# Altium schematic sheet resolver_ad2s1210.SchDoc
size B; SheetNumber: 13
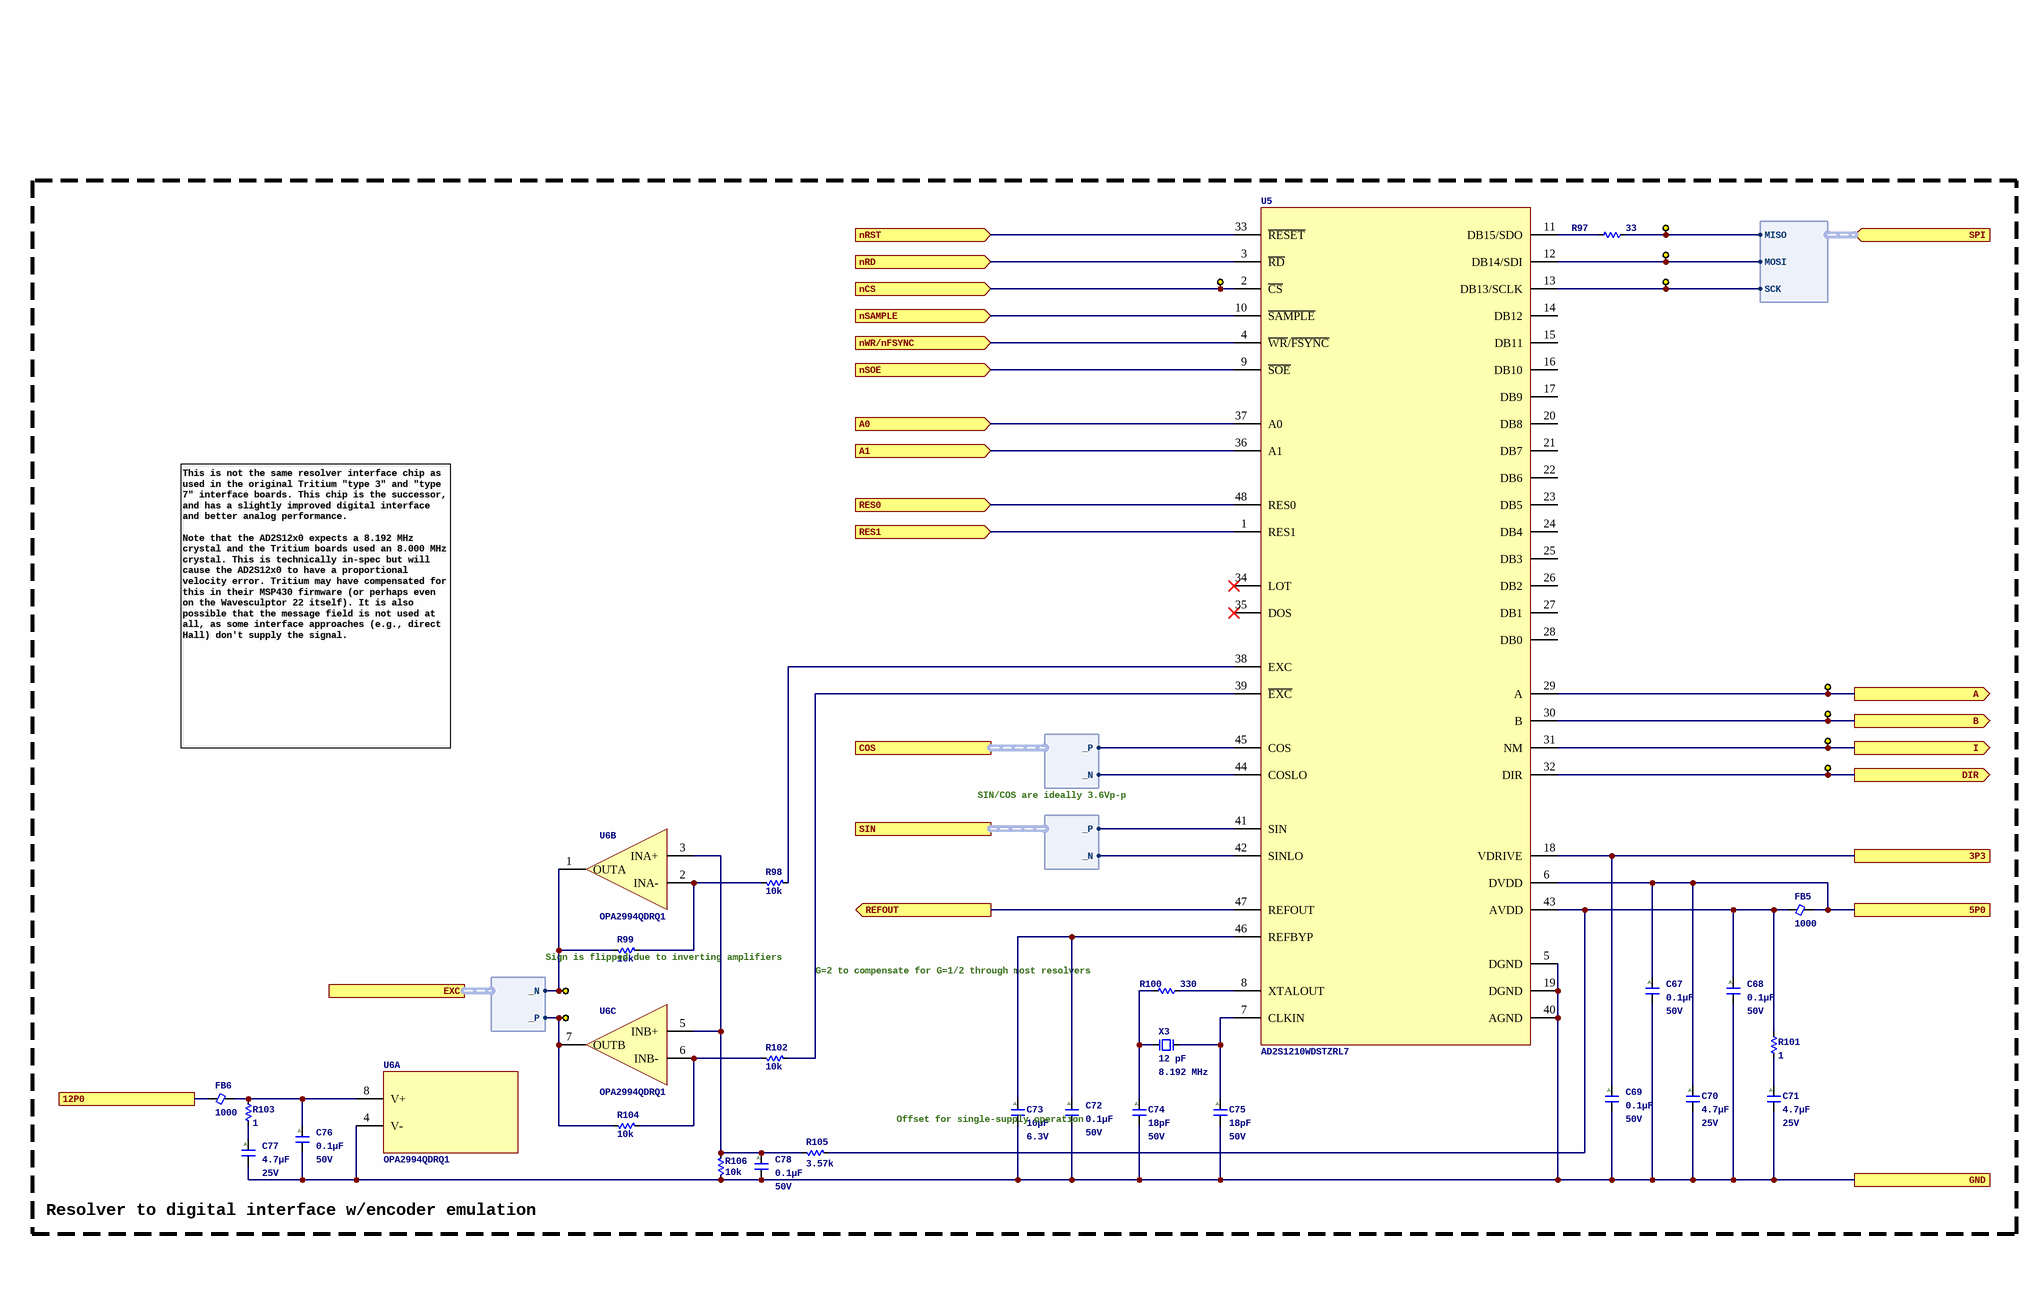
[diagram p0: resolver_ad2s1210.SchDoc]

## Parts
C67  Capacitance: 0.1µF  Voltage - Rated: 50V  [C0402_0.55MM]  (hidden comment: CGA2B3X7R1H104M050BB)
C68  Capacitance: 0.1µF  Voltage - Rated: 50V  [C0402_0.55MM]  (hidden comment: CGA2B3X7R1H104M050BB)
C69  Capacitance: 0.1µF  Voltage - Rated: 50V  [C0402_0.55MM]  (hidden comment: CGA2B3X7R1H104M050BB)
C70  Capacitance: 4.7µF  Voltage - Rated: 25V  [C0805_1.45MM]  (hidden comment: CGA4J1X7R1E475K125AC)
C71  Capacitance: 4.7µF  Voltage - Rated: 25V  [C0805_1.45MM]  (hidden comment: CGA4J1X7R1E475K125AC)
C72  Capacitance: 0.1µF  Voltage - Rated: 50V  [C0402_0.55MM]  (hidden comment: CGA2B3X7R1H104M050BB)
C73  Capacitance: 10µF  Voltage - Rated: 6.3V  [C0805_1.45MM]  (hidden comment: CGA4J1X7R0J106M125AC)
C74  Capacitance: 18pF  Voltage - Rated: 50V  [C0402_0.55MM]  (hidden comment: CGA2B2C0G1H180J050BA)
C75  Capacitance: 18pF  Voltage - Rated: 50V  [C0402_0.55MM]  (hidden comment: CGA2B2C0G1H180J050BA)
C76  Capacitance: 0.1µF  Voltage - Rated: 50V  [C0402_0.55MM]  (hidden comment: CGA2B3X7R1H104M050BB)
C77  Capacitance: 4.7µF  Voltage - Rated: 25V  [C0805_1.45MM]  (hidden comment: CGA4J1X7R1E475K125AC)
C78  Capacitance: 0.1µF  Voltage - Rated: 50V  [C0402_0.55MM]  (hidden comment: CGA2B3X7R1H104M050BB)
FB5  Impedance (Ohms @ 100MHz): 1000  [FB0805_1.05MM]  (hidden comment: MPZ2012S102AT000)
FB6  Impedance (Ohms @ 100MHz): 1000  [FB0805_1.05MM]  (hidden comment: MPZ2012S102AT000)
R97  Resistance: 33  [R0402_0.40MM]  (hidden comment: ERJ-2RKF33R0X)
R98  Resistance: 10k  [R0402_0.40MM]  (hidden comment: ERJ-2RKF1002X)
R99  Resistance: 10k  [R0402_0.40MM]  (hidden comment: ERJ-2RKF1002X)
R100  Resistance: 330  [R0402_0.40MM]  (hidden comment: ERJ-PA2F3300X)
R101  Resistance: 1  [R0402_0.40MM]  (hidden comment: ERJ-2BQF1R0X)
R102  Resistance: 10k  [R0402_0.40MM]  (hidden comment: ERJ-2RKF1002X)
R103  Resistance: 1  [R0402_0.40MM]  (hidden comment: ERJ-2BQF1R0X)
R104  Resistance: 10k  [R0402_0.40MM]  (hidden comment: ERJ-2RKF1002X)
R105  Resistance: 3.57k  [R0402_0.40MM]  (hidden comment: ERJ-2RKF3571X)
R106  Resistance: 10k  [R0402_0.40MM]  (hidden comment: ERJ-2RKF1002X)
TP5  (no value)  [TP_GRABBY]  (no BOM)
TP6  (no value)  [TP_GRABBY]  (no BOM)
TP7  (no value)  [TP_GRABBY]  (no BOM)
TP18  (no value)  [TP_GRABBY]  (no BOM)
TP19  (no value)  [TP_GRABBY]  (no BOM)
TP20  (no value)  [TP_GRABBY]  (no BOM)
TP21  (no value)  [TP_GRABBY]  (no BOM)
TP22  (no value)  [TP_GRABBY]  (no BOM)
TP23  RH-5002  [TP_RH-5002]  (value not drawn)
TP24  RH-5002  [TP_RH-5002]  (value not drawn)
U5  AD2S1210WDSTZRL7  [48TQFP7]
U6  OPA2994QDRQ1  [8SOIC150]  (parts A,B,C of 3)
X3  Load Capacitance: 12 pF  Frequency: 8.192 MHz  [XTAL_ECX-53Q]  (hidden comment: ECS-81.92-12-30Q-EN-TR)

## Ports
3P3, 5P0, 12P0, A0 (in), A1 (in), A (out), B (out), COS (harness DIFF), DIR (out), EXC (harness DIFF), GND, I (out), nCS (in), nRD (in), nRST (in), nSAMPLE (in), nSOE (in), nWR/nFSYNC (in), REFOUT (out), RES0 (in), RES1 (in), SIN (harness DIFF), SPI (in, harness SPI)

## Harnesses
DIFF: _P, _N
SPI: MISO, MOSI, SCK

## Nets
3P3: C69.1 U5.18(VDRIVE) ; port 3P3
5P0: C67.1 C70.1 FB5.2 U5.6(DVDD) ; port 5P0
12P0: FB6.1 ; port 12P0
A: TP18.1 U5.29(A) ; port A
A0: U5.37(A0) ; port A0
A1: U5.36(A1) ; port A1
B: TP19.1 U5.30(B) ; port B
DIR: TP21.1 U5.32(DIR) ; port DIR
GND: C67.2 C68.2 C69.2 C70.2 C71.2 C72.2 C73.2 C74.2 C75.2 C76.2 C77.2 C78.2 R106.2 U5.5(DGND) U5.19(DGND) U5.40(AGND) U6.4(V-) ; port GND
I: TP20.1 U5.31(NM) ; port I
nCS: TP22.1 U5.2(~{CS}) ; port nCS
nRD: U5.3(~{RD}) ; port nRD
nRST: U5.33(~{RESET}) ; port nRST
nSAMPLE: U5.10(~{SAMPLE}) ; port nSAMPLE
nSOE: U5.9(~{SOE}) ; port nSOE
nWR/nFSYNC: U5.4(~{WR}/~{FSYNC}) ; port nWR/nFSYNC
REFOUT: U5.47(REFOUT) ; port REFOUT
RES0: U5.48(RES0) ; port RES0
RES1: U5.1(RES1) ; port RES1
NetC68_1: C68.1 FB5.1 R101.2 R105.2 U5.43(AVDD)
NetC71_1: C71.1 R101.1
NetC72_1: C72.1 C73.1 U5.46(REFBYP)
NetC74_1: C74.1 R100.1 X3.1
NetC75_1: C75.1 U5.7(CLKIN) X3.2
NetC76_1: C76.1 FB6.2 R103.2 U6.8(V+)
NetC77_1: C77.1 R103.1
NetC78_1: C78.1 R105.1 R106.1 U6.3(INA+) U6.5(INB+)
NetR97_1: R97.1 TP5.1 ; port SPI.MISO
NetR97_2: R97.2 U5.11(DB15/SDO)
NetR98_1: R98.1 R99.2 U6.2(INA-)
NetR98_2: R98.2 U5.38(EXC)
NetR99_1: R99.1 TP23.1 U6.1(OUTA) ; port EXC._N
NetR100_2: R100.2 U5.8(XTALOUT)
NetR102_1: R102.1 R104.2 U6.6(INB-)
NetR102_2: R102.2 U5.39(~{EXC})
NetR104_1: R104.1 TP24.1 U6.7(OUTB) ; port EXC._P
NetTP6_1: TP6.1 U5.12(DB14/SDI) ; port SPI.MOSI
NetTP7_1: TP7.1 U5.13(DB13/SCLK) ; port SPI.SCK
NetU5_41: U5.41(SIN) ; port SIN._P
NetU5_42: U5.42(SINLO) ; port SIN._N
NetU5_44: U5.44(COSLO) ; port COS._N
NetU5_45: U5.45(COS) ; port COS._P

Not connected (* = marked no-connect by the designer): U5 14(DB12) 15(DB11) 16(DB10) 17(DB9) 20(DB8) 21(DB7) 22(DB6) 23(DB5) 24(DB4) 25(DB3) 26(DB2) 27(DB1) 28(DB0) 34(LOT)* 35(DOS)*

## Notes on the sheet
- This is not the same resolver interface chip as used in the original Tritium "type 3" and "type 7" interface boards. This chip is the successor, and has a slightly improved digital interface and better analog performance.
  Note that the AD2S12x0 expects a 8.192 MHz crystal and the Tritium boards used an 8.000 MHz crystal. This is technically in-spec but will cause the AD2S12x0 to have a proportional velocity error. Tritium may have compensated for this in their MSP430 firmware (or perhaps even on the Wavesculptor 22 itself). It is also possible that the message field is not used at all, as some interface approaches (e.g., direct Hall) don't supply the signal.
- SIN/COS are ideally 3.6Vp-p
- (near TP23) Sign is flipped due to inverting amplifiers
- G=2 to compensate for G=1/2 through most resolvers
- Offset for single-supply operation
- Resolver to digital interface w/encoder emulation
- (in symbol CGA2B2C0G1H180J050BA) A
- (in symbol CGA2B3X7R1H104M050BB) A
- (in symbol CGA4J1X7R0J106M125AC) A
- (in symbol CGA4J1X7R1E475K125AC) A

## Library data of the parts
C67-C69 C72 C76 C78 = CGA2B3X7R1H104M050BB: CAP CER 0.1UF 50V X7R 0402; Manufacturer: TDK Corporation; Unit Price (USD): 0.17; Tolerance: ±20%; ComponentLink1URL: https://product.tdk.com/info/en/catalog/datasheets/mlcc_automotive_general_en.pdf?ref_disty=digikey; ComponentLink1Description: Series Datasheet; Series: CGA; Part Status: Active; Temperature Coefficient: X7R; Operating Temperature: -55°C ~ 125°C; Applications: AEC-Q200; Mounting Type: Surface Mount, MLCC; Package / Case: 0402 (1005 Metric); Size / Dimension: 0.039" L x 0.020" W (1.00mm x 0.50mm); Thickness (Max): 0.022" (0.55mm); Supplier 1: Digikey; Supplier Part Number 1: 445-12271-1-ND; Manufacturer Part Number: CGA2B3X7R1H104M050BB
C70 C71 C77 = CGA4J1X7R1E475K125AC: CAP CER 4.7UF 25V X7R 0805; Manufacturer: TDK Corporation; Unit Price (USD): 0.56; Tolerance: ±10%; ComponentLink1URL: https://product.tdk.com/info/en/catalog/datasheets/mlcc_automotive_general_en.pdf?ref_disty=digikey; ComponentLink1Description: Series Datasheet; Series: CGA; Part Status: Active; Temperature Coefficient: X7R; Operating Temperature: -55°C ~ 125°C; Applications: AEC-Q200; Mounting Type: Surface Mount, MLCC; Package / Case: 0805 (2012 Metric); Size / Dimension: 0.079" L x 0.049" W (2.00mm x 1.25mm); Thickness (Max): 0.057" (1.45mm); Supplier 1: Digikey; Supplier Part Number 1: 445-6967-1-ND; Manufacturer Part Number: CGA4J1X7R1E475K125AC
C73 = CGA4J1X7R0J106M125AC: CAP CER 10UF 6.3V X7R 0805; Manufacturer: TDK Corporation; Unit Price (USD): 0.43; Tolerance: ±20%; ComponentLink1URL: https://product.tdk.com/info/en/catalog/datasheets/mlcc_automotive_general_en.pdf?ref_disty=digikey; ComponentLink1Description: Series Datasheet; Series: CGA; Part Status: Active; Temperature Coefficient: X7R; Operating Temperature: -55°C ~ 125°C; Applications: AEC-Q200; Mounting Type: Surface Mount, MLCC; Package / Case: 0805 (2012 Metric); Size / Dimension: 0.079" L x 0.049" W (2.00mm x 1.25mm); Thickness (Max): 0.057" (1.45mm); Supplier 1: Digikey; Supplier Part Number 1: 445-12776-1-ND; Manufacturer Part Number: CGA4J1X7R0J106M125AC
C74 C75 = CGA2B2C0G1H180J050BA: CAP CER 18PF 50V C0G 0402; Manufacturer: TDK Corporation; Unit Price (USD): 0.1; Tolerance: ±5%; Temperature Coefficient: C0G, NP0; ComponentLink1URL: https://product.tdk.com/info/en/catalog/datasheets/mlcc_automotive_general_en.pdf?ref_disty=digikey; ComponentLink1Description: Series Datasheet; Supplier 1: Digikey; Supplier Part Number 1: 445-5587-1-ND; Series: CGA; Part Status: Active; Operating Temperature: -55°C ~ 125°C; Applications: AEC-Q200; Mounting Type: Surface Mount, MLCC; Package / Case: 0402 (1005 Metric); Size / Dimension: 0.039" L x 0.020" W (1.00mm x 0.50mm); Thickness (Max): 0.022" (0.55mm); Manufacturer Part Number: CGA2B2C0G1H180J050BA
FB5 FB6 = MPZ2012S102AT000: FERRITE BEAD 1 KOHM 0805 1LN; Manufacturer: TDK Corporation; Filter Type: Power Line; Current Rating (Max): 1.5A; DC Resistance (DCR) (Max): 150mOhm; ComponentLink1URL: https://product.tdk.com/info/en/catalog/datasheets/beads_commercial_power_mpz2012_en.pdf?ref_disty=digikey; ComponentLink1Description: Datasheet; Series: MPZ; Part Status: Active; Operating Temperature: -55°C ~ 125°C; Package / Case: 0805 (2012 Metric); Mounting Type: Surface Mount; Height (Max): 0.041" (1.05mm); Size / Dimension: 0.079" L x 0.049" W (2.00mm x 1.25mm); Supplier Part Number 1: 445-5223-1-ND; Supplier 1: Digikey; Manufacturer Part Number: MPZ2012S102AT000
R97 = ERJ-2RKF33R0X: RES SMD 33 OHM 1% 1/10W 0402; Manufacturer: Panasonic Electronic Components; Unit Price (USD): 0.1; Power (Watts): 0.1W, 1/10W; Temperature Coefficient: ±100ppm/°C; ComponentLink1Description: Datasheet; ComponentLink1URL: https://industrial.panasonic.com/cdbs/www-data/pdf/RDA0000/AOA0000C304.pdf; Series: ERJ; Tolerance: ±1%; Composition: Thick Film; Features: Automotive AEC-Q200; Operating Temperature: -55°C ~ 155°C; Package / Case: 0402 (1005 Metric); Supplier Device Package: 0402; Size / Dimension: 0.039" L x 0.020" W (1.00mm x 0.50mm); Height - Seated (Max): 0.016" (0.40mm); Supplier 1: Digikey; Supplier Part Number 1: P33.0LCT-ND; Manufacturer Part Number: ERJ-2RKF33R0X
R98 R99 R102 R104 R106 = ERJ-2RKF1002X: RES SMD 10K OHM 1% 1/10W 0402; Manufacturer: Panasonic Electronic Components; Unit Price (USD): 0.1; Power (Watts): 0.1W, 1/10W; Temperature Coefficient: ±100ppm/°C; ComponentLink1Description: Datasheet; ComponentLink1URL: https://industrial.panasonic.com/cdbs/www-data/pdf/RDA0000/AOA0000C304.pdf; Series: ERJ; Tolerance: ±1%; Composition: Thick Film; Features: Automotive AEC-Q200; Operating Temperature: -55°C ~ 155°C; Package / Case: 0402 (1005 Metric); Supplier Device Package: 0402; Size / Dimension: 0.039" L x 0.020" W (1.00mm x 0.50mm); Height - Seated (Max): 0.016" (0.40mm); Supplier 1: Digikey; Supplier Part Number 1: P10.0KLCT-ND; Manufacturer Part Number: ERJ-2RKF1002X
R100 = ERJ-PA2F3300X: RES SMD 330 OHM 1% 1/5W 0402; Manufacturer: Panasonic Electronic Components; Unit Price (USD): 0.21; Power (Watts): 0.2W, 1/5W; Temperature Coefficient: ±100ppm/°C; ComponentLink1Description: Datasheet; ComponentLink1URL: https://industrial.panasonic.com/cdbs/www-data/pdf/RDO0000/AOA0000C331.pdf; Series: ERJ; Tolerance: ±1%; Composition: Thick Film; Features: Automotive AEC-Q200, Pulse Withstanding; Operating Temperature: -55°C ~ 155°C; Package / Case: 0402 (1005 Metric); Supplier Device Package: 0402; Size / Dimension: 0.039" L x 0.020" W (1.00mm x 0.50mm); Height - Seated (Max): 0.016" (0.40mm); Supplier 1: Digikey; Supplier Part Number 1: P17221CT-ND; Manufacturer Part Number: ERJ-PA2F3300X
R101 R103 = ERJ-2BQF1R0X: RES SMD 1 OHM 1% 1/6W 0402; Manufacturer: Panasonic Electronic Components; Unit Price (USD): 0.41; Power (Watts): 0.167W, 1/6W; Temperature Coefficient: ±250ppm/°C; ComponentLink1Description: Datasheet; ComponentLink1URL: https://industrial.panasonic.com/cdbs/www-data/pdf/RDN0000/AOA0000C313.pdf; Series: ERJ; Tolerance: ±1%; Composition: Thick Film; Features: Automotive AEC-Q200, Current Sense; Operating Temperature: -55°C ~ 125°C; Package / Case: 0402 (1005 Metric); Supplier Device Package: 0402; Size / Dimension: 0.039" L x 0.020" W (1.00mm x 0.50mm); Height - Seated (Max): 0.016" (0.40mm); Supplier 1: Digikey; Supplier Part Number 1: P17252CT-ND; Manufacturer Part Number: ERJ-2BQF1R0X
R105 = ERJ-2RKF3571X: RES SMD 3.57K OHM 1% 1/10W 0402; Manufacturer: Panasonic Electronic Components; Unit Price (USD): 0.1; Power (Watts): 0.1W, 1/10W; Temperature Coefficient: ±100ppm/°C; ComponentLink1Description: Datasheet; ComponentLink1URL: https://industrial.panasonic.com/cdbs/www-data/pdf/RDA0000/AOA0000C304.pdf; Series: ERJ; Tolerance: ±1%; Composition: Thick Film; Features: Automotive AEC-Q200; Operating Temperature: -55°C ~ 155°C; Package / Case: 0402 (1005 Metric); Supplier Device Package: 0402; Size / Dimension: 0.039" L x 0.020" W (1.00mm x 0.50mm); Height - Seated (Max): 0.016" (0.40mm); Supplier 1: Digikey; Supplier Part Number 1: P3.57KLCT-ND; Manufacturer Part Number: ERJ-2RKF3571X
TP5-TP7 TP18-TP22 = TEST_GRABBER: EMBEDDED TEST POINT FOR SALEAE TEST CLIPS
TP23 TP24 = RH-5002: THT white clip turret; Manufacturer: ronghe; ComponentLink1Description: Datasheet; ComponentLink1URL: https://datasheet.lcsc.com/lcsc/2307040929_ronghe-RH-5000_C5277086.pdf; Supplier 1: LCSC; Supplier Part Number 1: C5199802; Manufacturer Part Number: RH-5002
U5 = RESOLVER_AD2S1210WDSTZ: Synchro or Resolver to Digital Converter, PQFP44; Manufacturer: Analog Devices; Supplier 1: Digikey; Supplier Part Number 1: 505-AD2S1210WDSTZRL7CT-ND; Manufacturer Part Number: AD2S1210WDSTZRL7; ComponentLink1Description: Datasheet; ComponentLink1URL: https://www.analog.com/media/en/technical-documentation/data-sheets/AD2S1210.pdf; Supplier 2: LCSC; Supplier Part Number 2: C459871
U6 = OPAMP_OPA2994QDRQ1: Automotive, dual, 24V 25MHz high-output-current (150 mA) operational amplifier 8-SOIC -40 to 125; Manufacturer: Texas Instruments; Supplier 1: Digikey; Supplier Part Number 1: 296-OPA2994QDRQ1CT-ND; Manufacturer Part Number: OPA2994QDRQ1; Supplier 2: LCSC; Supplier Part Number 2: C4369938; ComponentLink1Description: Datasheet; ComponentLink1URL: https://www.ti.com/lit/ds/symlink/opa2994-q1.pdf
X3 = XTAL_ECS-81.92-12-30Q-EN-TR: Parallel - Fundamental Quartz Crystal, 8.192MHz Nom; Manufacturer: ECS International; Supplier 1: Digikey; Supplier Part Number 1: XC3145CT-ND; Manufacturer Part Number: ECS-81.92-12-30Q-EN-TR; Supplier 2: LCSC; Supplier Part Number 2: C2450755; ComponentLink1Description: Datasheet; ComponentLink1URL: https://ecsxtal.com/store/pdf/ECX-53Q.pdf